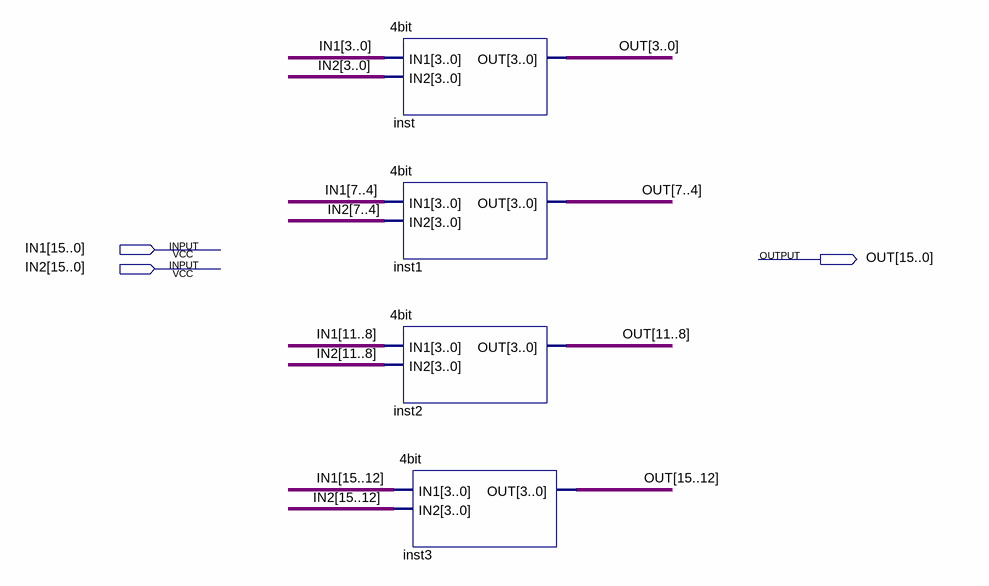
[diagram p0: schematic sheet]
// Quartus schematic 16bit.bdf as structural Verilog: 4 symbols, 3 pins
module \16bit  (
  input  [15:0] IN1,
  input  [15:0] IN2,
  output [15:0] OUT
);

  \4bit  inst (.IN1(IN1[3:0]), .IN2(IN2[3:0]), .OUT(OUT[3:0]));
  \4bit  inst1 (.IN1(IN1[7:4]), .IN2(IN2[7:4]), .OUT(OUT[7:4]));
  \4bit  inst2 (.IN1(IN1[11:8]), .IN2(IN2[11:8]), .OUT(OUT[11:8]));
  \4bit  inst3 (.IN1(IN1[15:12]), .IN2(IN2[15:12]), .OUT(OUT[15:12]));
endmodule
